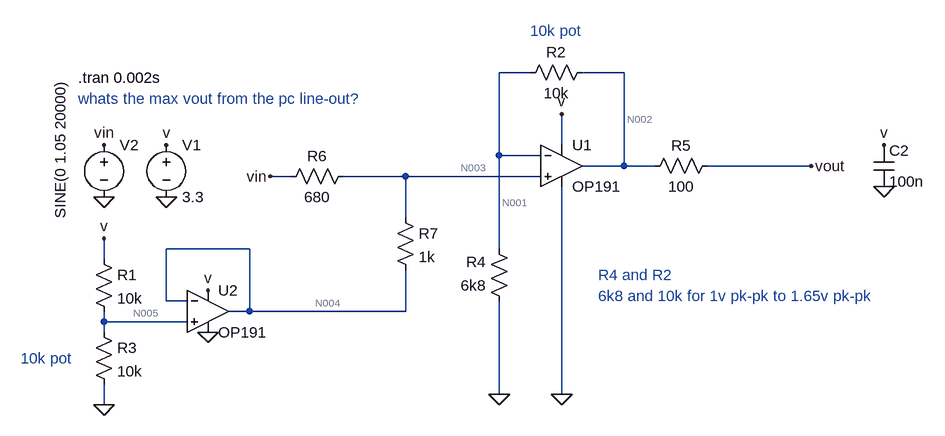
[diagram p0: schematic XY-AFE.asc]
XY-AFE.asc, the LTspice schematic file:
Version 4
SHEET 1 1044 680
WIRE 432 64 384 64
WIRE 576 64 512 64
WIRE 480 176 480 128
WIRE 384 192 384 64
WIRE 448 192 384 192
WIRE 576 208 576 64
WIRE 576 208 512 208
WIRE 624 208 576 208
WIRE 864 208 704 208
WIRE 64 224 32 224
WIRE 240 224 144 224
WIRE 448 224 240 224
WIRE 240 288 240 224
WIRE 0 336 -128 336
WIRE 384 336 384 192
WIRE -224 352 -224 320
WIRE -128 416 -128 336
WIRE -96 416 -128 416
WIRE 0 432 0 336
WIRE 0 432 -32 432
WIRE 240 432 240 368
WIRE 240 432 0 432
WIRE -224 448 -224 432
WIRE -96 448 -224 448
WIRE -224 464 -224 448
WIRE 384 560 384 416
WIRE 480 560 480 240
WIRE -224 576 -224 544
FLAG 480 560 0
FLAG -128 256 0
FLAG -128 176 v
FLAG 480 128 v
FLAG 384 560 0
FLAG 864 208 vout
FLAG -224 256 0
FLAG -224 176 vin
FLAG 32 224 vin
FLAG -224 576 0
FLAG -224 320 v
FLAG 976 240 0
FLAG 976 176 v
FLAG -64 464 0
FLAG -64 400 v
DATAFLAG 240 224 ""
DATAFLAG 784 208 ""
DATAFLAG 128 432 ""
SYMBOL OpAmps\\OP191 480 144 R0
SYMATTR InstName U1
SYMBOL voltage -128 160 R0
WINDOW 123 0 0 Left 0
WINDOW 39 0 0 Left 0
SYMATTR InstName V1
SYMATTR Value 3.3
SYMBOL res 528 48 R90
WINDOW 0 0 56 VBottom 2
WINDOW 3 32 56 VTop 2
SYMATTR InstName R2
SYMATTR Value 10k
SYMBOL res 400 432 R180
WINDOW 0 36 76 Left 2
WINDOW 3 36 40 Left 2
SYMATTR InstName R4
SYMATTR Value 6k8
SYMBOL res 720 192 R90
WINDOW 0 0 56 VBottom 2
WINDOW 3 32 56 VTop 2
SYMATTR InstName R5
SYMATTR Value 100
SYMBOL voltage -224 160 R0
WINDOW 3 -67 -84 VRight 2
WINDOW 123 0 0 Left 0
WINDOW 39 0 0 Left 0
SYMATTR Value SINE(0 1.05 20000)
SYMATTR InstName V2
SYMBOL res -240 336 R0
SYMATTR InstName R1
SYMATTR Value 10k
SYMBOL res -240 448 R0
SYMATTR InstName R3
SYMATTR Value 10k
SYMBOL res 160 208 R90
WINDOW 0 0 56 VBottom 2
WINDOW 3 32 56 VTop 2
SYMATTR InstName R6
SYMATTR Value 680
SYMBOL cap 960 176 R0
SYMATTR InstName C2
SYMATTR Value 100n
SYMBOL OpAmps\\OP191 -64 368 R0
SYMATTR InstName U2
SYMBOL res 224 272 R0
SYMATTR InstName R7
SYMATTR Value 1k
TEXT -264 72 Left 2 !.tran 0.002s
TEXT 536 408 Left 2 ;6k8 and 10k for 1v pk-pk to 1.65v pk-pk
TEXT 536 376 Left 2 ;R4 and R2
TEXT -264 104 Left 2 ;whats the max vout from the pc line-out?
TEXT 432 0 Left 2 ;10k pot
TEXT -352 504 Left 2 ;10k pot

The netlist it stands for:
* XY-AFE.asc
XU1 N003 N001 v 0 N002 OP191  ; pins In+ In- V+ V- OUT
V1 v 0 3.3
R2 N002 N001 10k
R4 0 N001 6k8
R5 vout N002 100
V2 vin 0 SINE(0 1.05 20000)
R1 v N005 10k
R3 N005 0 10k
R6 N003 vin 680
C2 v 0 100n
XU2 N005 N004 v 0 N004 OP191  ; pins In+ In- V+ V- OUT
R7 N003 N004 1k
.tran 0.002s
* 6k8 and 10k for 1v pk-pk to 1.65v pk-pk
* R4 and R2
* whats the max vout from the pc line-out?
* 10k pot
* 10k pot
.lib ADI.lib
.backanno
.end

* Results of the author's LTspice run, read from the files saved beside the schematic
* Operating Point, zero values left out:
*   V(v) = 3.3 V
*   V(n001) = 667.8 mV
*   V(n003) = 667.9 mV
*   V(n002) = 1.65 V
*   V(vout) = 1.65 V
*   V(n005) = 1.65 V
*   V(n004) = 1.65 V
*   I(R2) = 98.18 µA
*   I(R4) = -98.21 µA
*   I(R1) = 165 µA
*   I(R3) = 165 µA
*   I(R6) = 982.2 µA
*   I(R7) = -982.2 µA
*   I(V1) = -1.705 mA
*   I(V2) = 982.2 µA
*   Ix(u1:1) = -29.96 nA
*   Ix(u1:2) = -30.06 nA
*   Ix(u1:99) = 328 µA
*   Ix(u1:50) = -229.8 µA
*   Ix(u1:45) = -98.18 µA
*   Ix(u2:1) = -29.95 nA
*   Ix(u2:2) = -30.05 nA
*   Ix(u2:99) = 1.212 mA
*   Ix(u2:50) = -229.8 µA
*   Ix(u2:45) = -982.1 µA
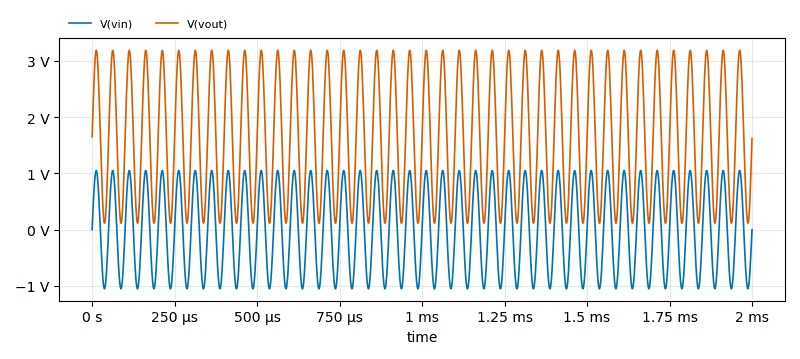
[diagram p1: Transient Analysis of XY-AFE.asc, plotted from the saved traces]
* Transient Analysis, 1 run:
*   V(vin): min -1.05 V, max 1.05 V, average 64.59 µV, rms 744 mV, last 0 V
*   V(vout): min 114.7 mV, max 3.184 V, average 1.65 V, rms 1.975 V, last 1.619 V